# EAGLE design Schematic (EAGLE 9.1.3)
CNAME: RC Plane Landing Lights
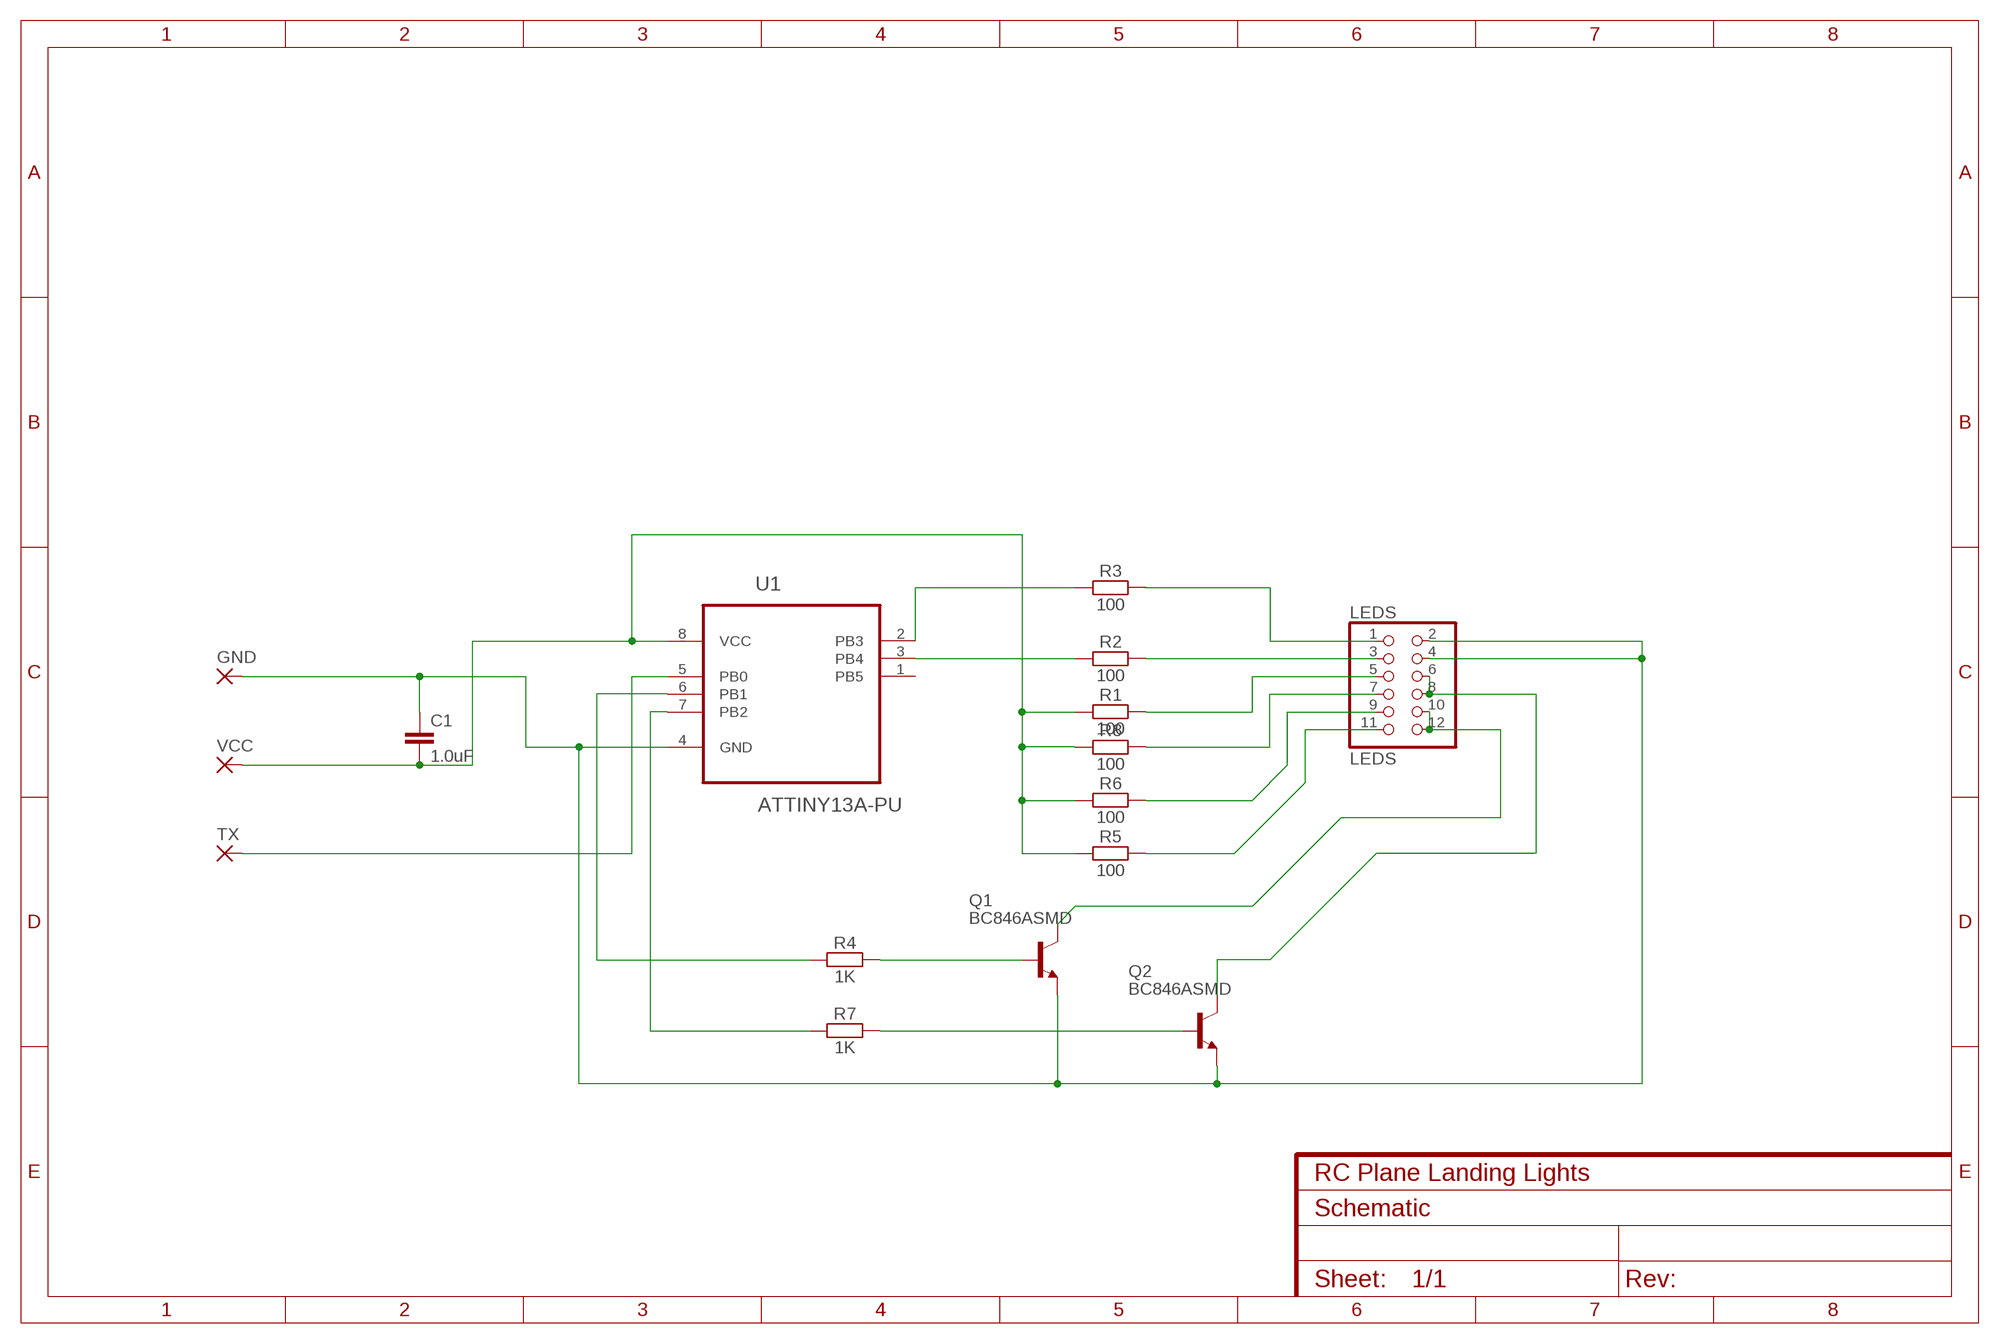
[diagram p0: schematic, sheet 1]

## Parts
C1  1.0uF  1.0UF-0805-25V-(+80/-20%)  [0805]
GND  3,17/1,1  [3,17/1,1]
LEDS  LEDS  PINHD-2X06_2.54-90°  [2X06/90]
Q1  BC846ASMD  [SOT23]
Q2  BC846ASMD  [SOT23]
R1  100  RESISTOR0805  [0805]
R2  100  RESISTOR0805  [0805]
R3  100  RESISTOR0805  [0805]
R4  1K  RESISTOR0805  [0805]
R5  100  RESISTOR0805  [0805]
R6  100  RESISTOR0805  [0805]
R7  1K  RESISTOR0805  [0805]
R8  100  RESISTOR0805  [0805]
TX  3,17/1,1  [3,17/1,1]
U1  ATTINY13A-PU  [DIP254P762X533-8]
VCC  3,17/1,1  [3,17/1,1]

## Nets
N$1: C1.1 GND.1(P) LEDS.2 LEDS.4 Q1.2(E) Q2.2(E) U1.4(GND)
N$2: C1.2 R1.1 R5.1 R6.1 R8.1 U1.8(VCC) VCC.1(P)
N$3: TX.1(P) U1.5(PB0)
N$4: R3.1 U1.2(PB3)
N$5: LEDS.1 R3.2
N$6: R2.1 U1.3(PB4)
N$7: LEDS.3 R2.2
N$8: R7.1 U1.7(PB2)
N$9: LEDS.5 R1.2
N$10: Q1.1(B) R4.2
N$11: R4.1 U1.6(PB1)
N$12: LEDS.9 R6.2
N$13: LEDS.11 R5.2
N$14: LEDS.10 LEDS.12 Q1.3(C)
N$15: Q2.1(B) R7.2
N$16: LEDS.7 R8.2
N$17: LEDS.6 LEDS.8 Q2.3(C)
Unconnected: U1.1(PB5)

## Library data of the parts
C1 = CodeWorks-Capacitors:1.0UF: 1µF ceramic capacitors A capacitor is a passive two-terminal electrical component used to store electrical energy temporarily in an electric field.; PROD_ID: CAP-11625
GND = CodeWorks:3,17/1,1: THROUGH-HOLE PAD; SPICEPREFIX: X
LEDS = CodeWorks-Connectors:PINHD-2X06: PIN HEADER
Q1 Q2 = transistor-npn:BC846*: NPN Transistor
R1-R8 = CodeWorks-Resistors:RESISTOR: Generic Resistor Package
TX VCC = CodeWorks:3,17/1,1: THROUGH-HOLE PAD
U1 = CodeWorks-IO:ATTINY13A-PU: 8-bit Microcontroller with 1K Bytes In-System Programmable Flash; MPN: ATTINY13A-PU; OC_FARNELL: 1704566; OC_NEWARK: 08R5495; PACKAGE: PDIP-8; SUPPLIER: Atmel

## Board
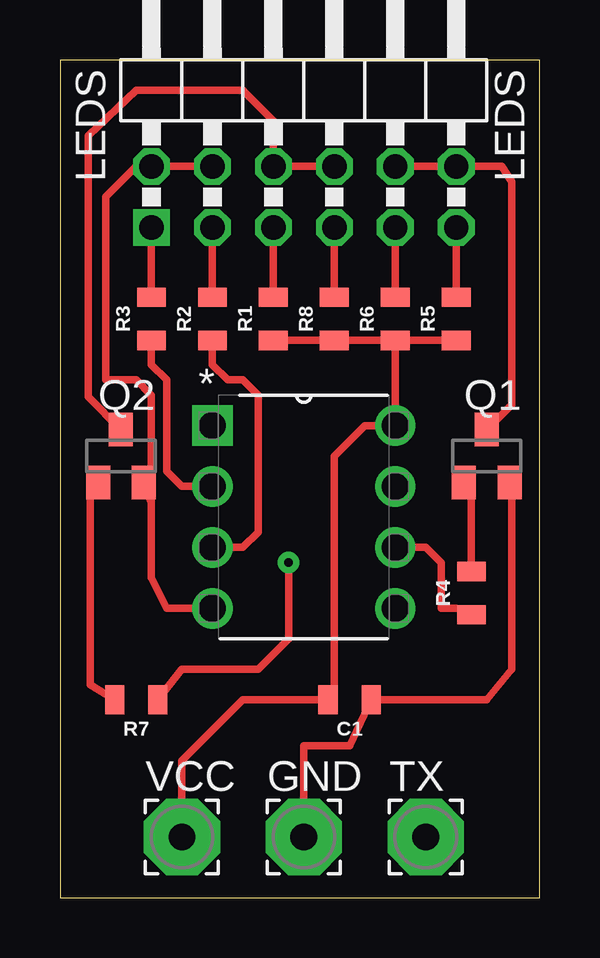
[diagram p1: board, top side]
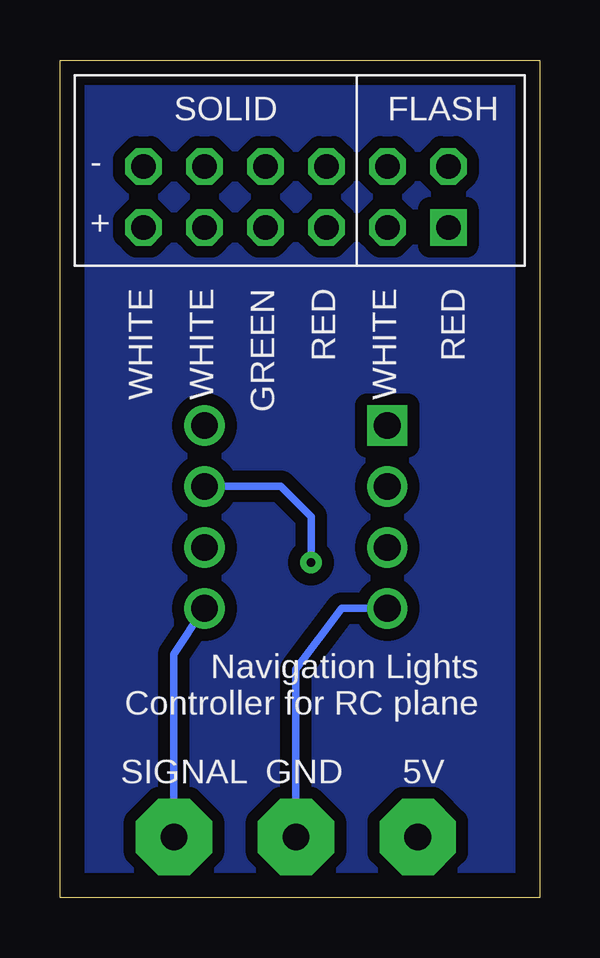
[diagram p2: board, bottom side, seen from below]

Size 19.99 x 34.91 mm. Coordinates in mm from the lower left corner, seen from the top.
Outline: 0,0 19.99,0 19.99,34.91 0,34.91 0,0
Copper layers (1*16): Top 0.035mm / dielectric 1.5mm / Bottom 0.035mm
Design rules "default": minimum track width 6mil, minimum drill 0.35mm, track to track 6mil, track to pad 6mil, pad to pad 6mil, via to via 6mil, smd to smd 6mil, copper to edge 40mil, drill to drill 6mil, minimum pad ring 10mil, minimum via ring 8mil, stop-mask expansion 4mil, vias tented up to drill 0mil, thermal gap 10mil

### Footprints (pad centres in the part's own frame; a part is rotated, then mirrored left to right if it is on the bottom)
0805 = smd 0.8 x 1.2: 1 -0.9,0; 2 0.9,0
3,17/1,1 = drill 1.118 pad 3.175 octagon: 1 0,0
2X06/90 = drill 1.016 square: 1 -6.35,-6.35 | drill 1.016 octagon: 2 -6.35,-3.81; 3 -3.81,-6.35; 4 -3.81,-3.81; 5 -1.27,-6.35; 6 -1.27,-3.81; 7 1.27,-6.35; 8 1.27,-3.81; 9 3.81,-6.35; 10 3.81,-3.81; 11 6.35,-6.35; 12 6.35,-3.81
SOT23 = smd 1 x 1.4: 1 -0.95,-1.1; 2 0.95,-1.1; 3 0,1.1
DIP254P762X533-8 = drill 1.118 square: 1 -7.62,7.62 | drill 1.118: 2 -7.62,5.08; 3 -7.62,2.54; 4 -7.62,0; 5 0,0; 6 0,2.54; 7 0,5.08; 8 0,7.62

### Placement (x,y rotation side)
C1  12.06,8.26 180 top
GND  10.16,2.54 0 top
LEDS  10.16,34.29 0 top
Q1  17.78,18.41 0 top
Q2  2.54,18.41 0 top
R1  8.89,24.13 90 top
R2  6.35,24.13 90 top
R3  3.81,24.13 90 top
R4  17.14,12.7 90 top
R5  16.51,24.13 90 top
R6  13.97,24.13 90 top
R7  3.17,8.26 180 top
R8  11.43,24.13 90 top
TX  15.24,2.54 0 top
U1  13.97,12.06 0 top
VCC  5.08,2.54 0 top

### Tracks (layer width: path | path; a pad name or v marks a point on that pad's centre or on a via)
GND
  pour Bottom (isolate 0.5): 19.68,34.61 0.32,34.61 0.32,0.32 19.68,0.32
N$1
  Top 0.305: LEDS.4 LEDS.2 3.17,30.48 1.91,29.21 1.91,21.59 3.17,21.59 3.81,20.95 3.81,17.78 Q2.2 3.81,16.51 3.81,13.34 4.45,12.06 U1.4 | Q1.2 18.82,17.22 18.82,9.53 17.78,8.26 C1.1 12.06,6.35 10.16,6.35 GND.1
  Bottom 0.305: U1.4 8.26,12.06 10.16,9.53 GND.1
N$2
  Top 0.305: R6.1 U1.8 12.7,19.68 11.43,18.41 11.43,8.26 C1.2 7.62,8.26 5.08,5.71 VCC.1 | R5.1 R6.1 | R6.1 R8.1 R1.1
N$3
  Bottom 0.305: U1.5 15.24,10.16 TX.1
N$4
  Top 0.305: U1.2 5.08,17.14 4.45,17.78 4.45,21.59 3.81,22.23 R3.1
N$5
  Top 0.305: R3.2 LEDS.1
N$6
  Top 0.305: R2.1 6.35,22.23 6.99,21.59 7.62,21.59 8.26,20.95 8.26,15.24 7.62,14.61 U1.3
N$7
  Top 0.305: LEDS.3 R2.2
N$8  (via drill 0.35 pad 0.9)
  Top 0.305: v9.53,13.97 9.53,10.79 8.26,9.53 5.08,9.53 R7.1
  Bottom 0.305: U1.7 10.79,17.14 9.53,15.88 v9.53,13.97
N$9
  Top 0.305: LEDS.5 R1.2
N$10
  Top 0.305: R4.2 17.14,17.14 Q1.1
N$11
  Top 0.305: U1.6 15.24,14.61 15.88,13.97 15.88,12.06 16.51,12.06 R4.1
N$12
  Top 0.305: LEDS.9 R6.2
N$13
  Top 0.305: LEDS.11 R5.2
N$14
  Top 0.305: Q1.3 18.82,20.56 18.82,29.84 18.41,30.48 LEDS.12 LEDS.10
N$15
  Top 0.305: R7.2 1.27,8.89 1.27,17.14 Q2.1
N$16
  Top 0.305: LEDS.7 R8.2
N$17
  Top 0.305: LEDS.8 LEDS.6 8.89,31.11 8.89,32.38 7.62,33.66 3.17,33.66 1.17,31.75 1.17,20.89 Q2.3

### Text on the board
bNames: FLASH | SOLID | - | + | RED | WHITE | RED | GREEN | WHITE | WHITE | Navigation Lights / Controller for RC plane | 5V | GND | SIGNAL